# Altium schematic sheet currgenTPAv2.SchDoc
size A4
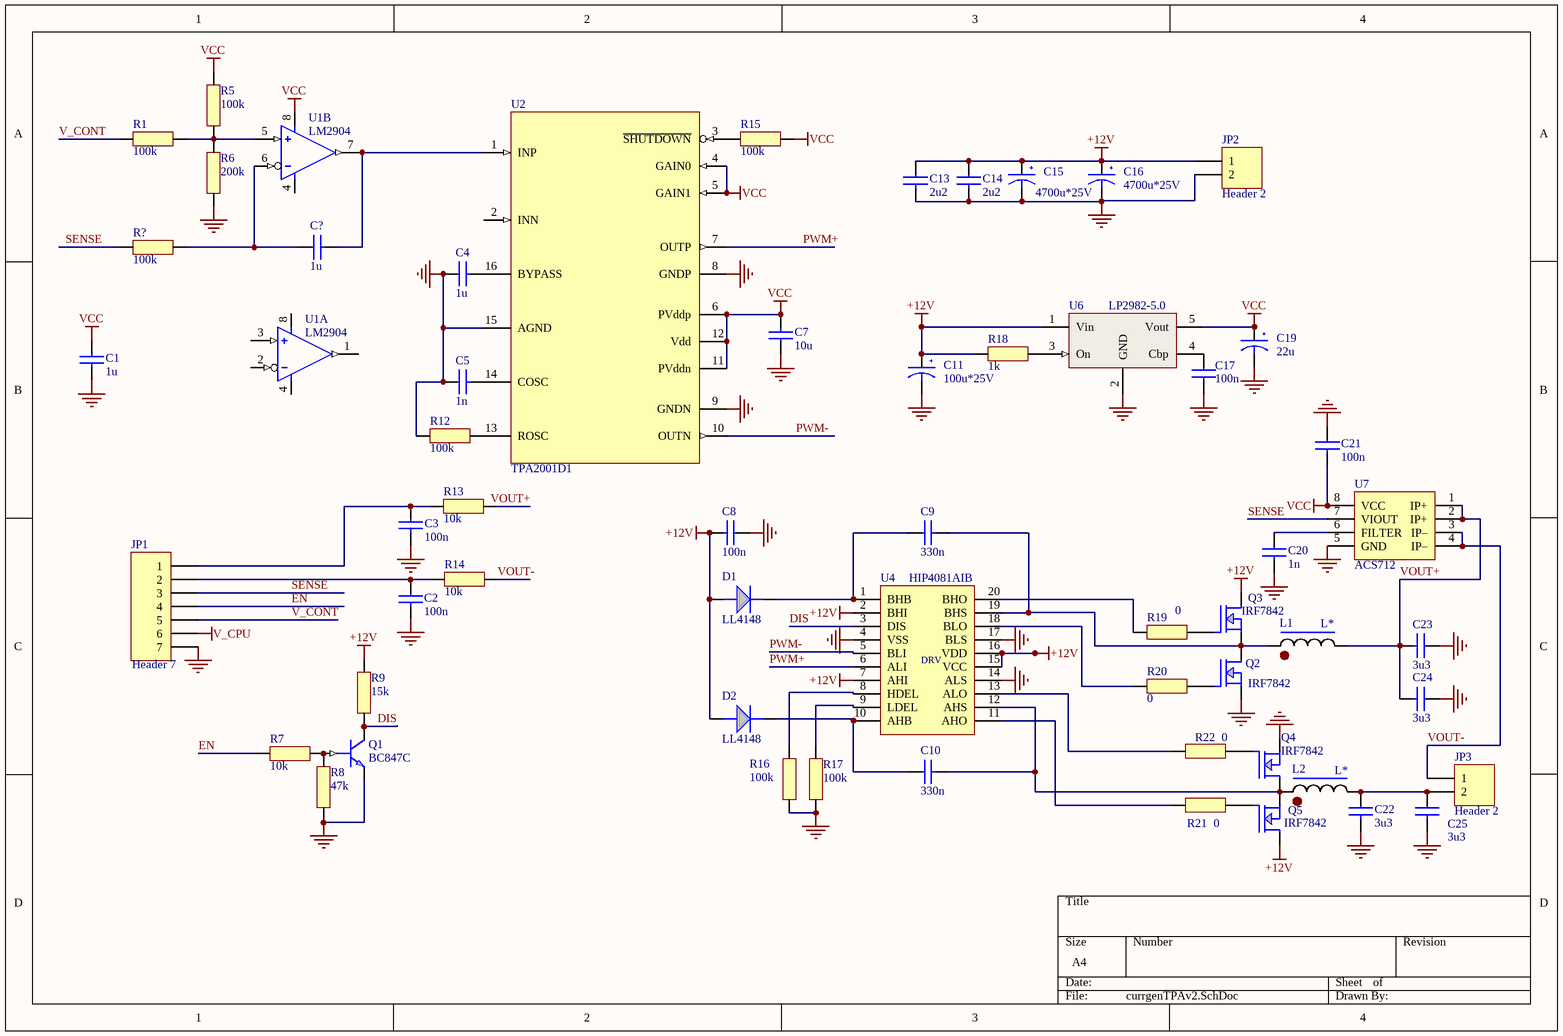
[diagram p0: currgenTPAv2.SchDoc]

## Parts
C1  1u  [C-0805]
C2  100n  [C-0805]
C3  100n  [C-0805]
C4  1u  [C-0805]
C5  1n  [C-0805]
C7  10u  [C-0805]
C8  100n  [C-0805]
C9  330n  [C-0805]
C10  330n  [C-0805]
C11  100u*25V  [EXR-6.3X11]
C13  2u2  [C-1206]
C14  2u2  [C-1206]
C15  4700u*25V  [EXR-10X12.5]
C16  4700u*25V  [EXR-10X12.5]
C17  100n  [C-0805]
C19  22u  [TANTAL-A]
C20  1n  [C-0805]
C21  100n  [C-0805]
C22  3u3  [C-1206]
C23  3u3  [C-1206]
C24  3u3  [C-1206]
C25  3u3  [C-1206]
C?  1u  [C-0805]
D1  LL4148  [SOD-80]
D2  LL4148  [SOD-80]
JP1  Header 7  [HDR1X7]
JP2  Header 2  [KLEMMA2]
JP3  Header 2  [KLEMMA2]
L1  L*  [L_TOR]
L2  L*  [L_TOR]
Q1  BC847C  [SOT-23]
Q2  IRF7842  [SO8_MOSFET]
Q3  IRF7842  [SO8_MOSFET]
Q4  IRF7842  [SO8_MOSFET]
Q5  IRF7842  [SO8_MOSFET]
R1  100k  [R-0805]
R5  100k  [R-0805]
R6  200k  [R-0805]
R7  10k  [R-0805]
R8  47k  [R-0805]
R9  15k  [R-0805]
R12  100k  [R-0805]
R13  10k  [R-0805]
R14  10k  [R-0805]
R15  100k  [R-0805]
R16  100k  [R-0805]
R17  100k  [R-0805]
R18  1k  [R-0805]
R19  0  [R-0805]
R20  0  [R-0805]
R21  0  [R-0805]
R22  0  [R-0805]
R?  100k  [R-0805]
U1  LM2904  [SO8-(SOT-96-1)]  (parts A,B of 2)
U2  TPA2001D1  [TSSOP16-(SOT-403-1)]
U4  HIP4081AIB  [SO20-(SOT-163-1)]
U6  LP2982-5.0  [SOT-23-5]
U7  ACS712  [SO8-(SOT-96-1)]

## Nets
1: Q2.2(SOURCE) Q2.3(SOURCE) Q3.2(SOURCE) Q3.3(SOURCE) Q4.2(SOURCE) Q4.3(SOURCE) Q5.2(SOURCE) Q5.3(SOURCE)
5: Q2.6(DRAIN) Q2.7(DRAIN) Q2.8(DRAIN) Q3.6(DRAIN) Q3.7(DRAIN) Q3.8(DRAIN) Q4.6(DRAIN) Q4.7(DRAIN) Q4.8(DRAIN) Q5.6(DRAIN) Q5.7(DRAIN) Q5.8(DRAIN)
+12V: C8.2 C11.2(+) C13.1 C14.1 C15.2(+) C16.2(+) D1.A D2.A JP2.1 Q3.5(DRAIN) Q5.5(DRAIN) R9.1 R18.1 U4.2(BHI) U4.7(AHI) U4.15(VCC) U4.16(VDD) U6.1(Vin)
GND: C1.2 C3.2 C4.1 C5.1 C7.1 C8.1 C11.1(-) C13.2 C14.2 C15.1(-) C16.1(-) C17.2 C19.1(-) C20.2 C21.1 C22.2 C23.1 C24.1 C25.2 JP1.7 JP2.2 Q1.1(EMITTER) Q2.1(SOURCE) Q4.1(SOURCE) R6.2 R8.2 R12.2 R16.1 R17.1 U2.8(GNDP) U2.9(GNDN) U2.15(AGND) U4.4(VSS) U4.14(ALS) U4.17(BLS) U6.2(GND) U7.5(GND)
V_CPU: JP1.6
VCC: C1.1 C7.2 C19.2(+) C21.2 R5.1 R15.2 U1.8(V+) U2.4(GAIN0) U2.5(GAIN1) U2.6(PVddp) U2.11(PVddn) U2.12(Vdd) U6.5(Vout) U7.8(VCC)
DIS: Q1.3(COLLECTOR) R9.2 U4.3(DIS)
EN: JP1.4 R7.1
PWM+: U2.7(OUTP) U4.6(ALI)
PWM-: U2.10(OUTN) U4.5(BLI)
SENSE: JP1.3 R?.1 U7.7(VIOUT)
V_CONT: JP1.5 R1.1
VOUT+: C23.2 C24.2 L1.2 U7.1(IP+) U7.2(IP+)
VOUT-: JP3.1 U7.3(IP–) U7.4(IP–)
NetC2_1: C2.1 JP1.2 R14.1
NetC3_1: C3.1 JP1.1 R13.1
NetC4_2: C4.2 U2.16(BYPASS)
NetC5_2: C5.2 U2.14(COSC)
NetC9_1: C9.1 D1.K U4.1(BHB)
NetC9_2: C9.2 L1.1 Q2.5(DRAIN) Q3.1(SOURCE) U4.19(BHS)
NetC10_1: C10.1 D2.K U4.10(AHB)
NetC10_2: C10.2 L2.1 Q4.5(DRAIN) Q5.1(SOURCE) U4.12(AHS)
NetC17_1: C17.1 U6.4(Cbp)
NetC20_1: C20.1 U7.6(FILTER)
NetC22_1: C22.1 C25.1 JP3.2 L2.2
NetC?_1: C?.1 R?.2 U1.6(-IN)
NetC?_2: C?.2 U1.7(OUT) U2.1(INP)
NetQ1_2: Q1.2(BASE) R7.2 R8.1
NetQ2_4: Q2.4(GATE) R20.2
NetQ3_4: Q3.4(GATE) R19.2
NetQ4_4: Q4.4(GATE) R22.2
NetQ5_4: Q5.4(GATE) R21.2
NetR1_2: R1.2 R5.2 R6.1 U1.5(+IN)
NetR12_1: R12.1 U2.13(ROSC)
NetR15_1: R15.1 U2.3(~{SHUTDOWN})
NetR16_2: R16.2 U4.8(HDEL)
NetR17_2: R17.2 U4.9(LDEL)
NetR18_2: R18.2 U6.3(On)
NetR19_1: R19.1 U4.20(BHO)
NetR20_1: R20.1 U4.18(BLO)
NetR21_1: R21.1 U4.11(AHO)
NetR22_1: R22.1 U4.13(ALO)

Not connected (* = marked no-connect by the designer): C2 2; R13 2; R14 2; U1 1(OUT) 2(-IN) 3(+IN) 4(V-); U2 2(INN)

## Notes on the sheet
- Labels drawn without touching a wire or pin: GND, VOUT+, VOUT-
- (in symbol HIP4081AIB) DRV

## Library data of the parts
C1-C5 C7-C10 C13 C14 C17 C20-C25 C? = C: Производитель: *; Точность: *; Напряжение: *; Тип диэлектрика: *
C11 C15 C16 = C-EL-DIP: Производитель: *; Точность: *; Напряжение: *; Тип диэлектрика: *
C19 = C-EL-TAN: Производитель: *; Точность: *; Напряжение: *; Тип диэлектрика: *
D1 D2 = DIODE
JP1 = Header 7: Header, 7-Pin; LatestRevisionDate: 17-Jul-2002; LatestRevisionNote: Re-released for DXP Platform.; Publisher: Altium Limited
JP2 JP3 = Header 2: Header, 2-Pin; LatestRevisionDate: 17-Jul-2002; LatestRevisionNote: Re-released for DXP Platform.; Publisher: Altium Limited
Q1 = NPN
R1 R5-R9 R12-R22 R? = R: Производитель: *; Точность: *; Тип: *
U1 = LM2904: 2 Operation amplifier; Производитель: *; Допустимая замена: *; Цена: *; PDF файл: *; Температурный диапазон: *
U2 = TPA2001D1: 1-W FILTERLESS MONO AUDIO POWER AMPLIFIER; Производитель: *; Допустимая замена: *; Цена: *; PDF файл: *; Температурный диапазон: *
U6 = LP2982: 50mA Ultra Low-Dropout Regulator; Производитель: *; Допустимая замена: *; Цена: *; PDF файл: *; Температурный диапазон: *